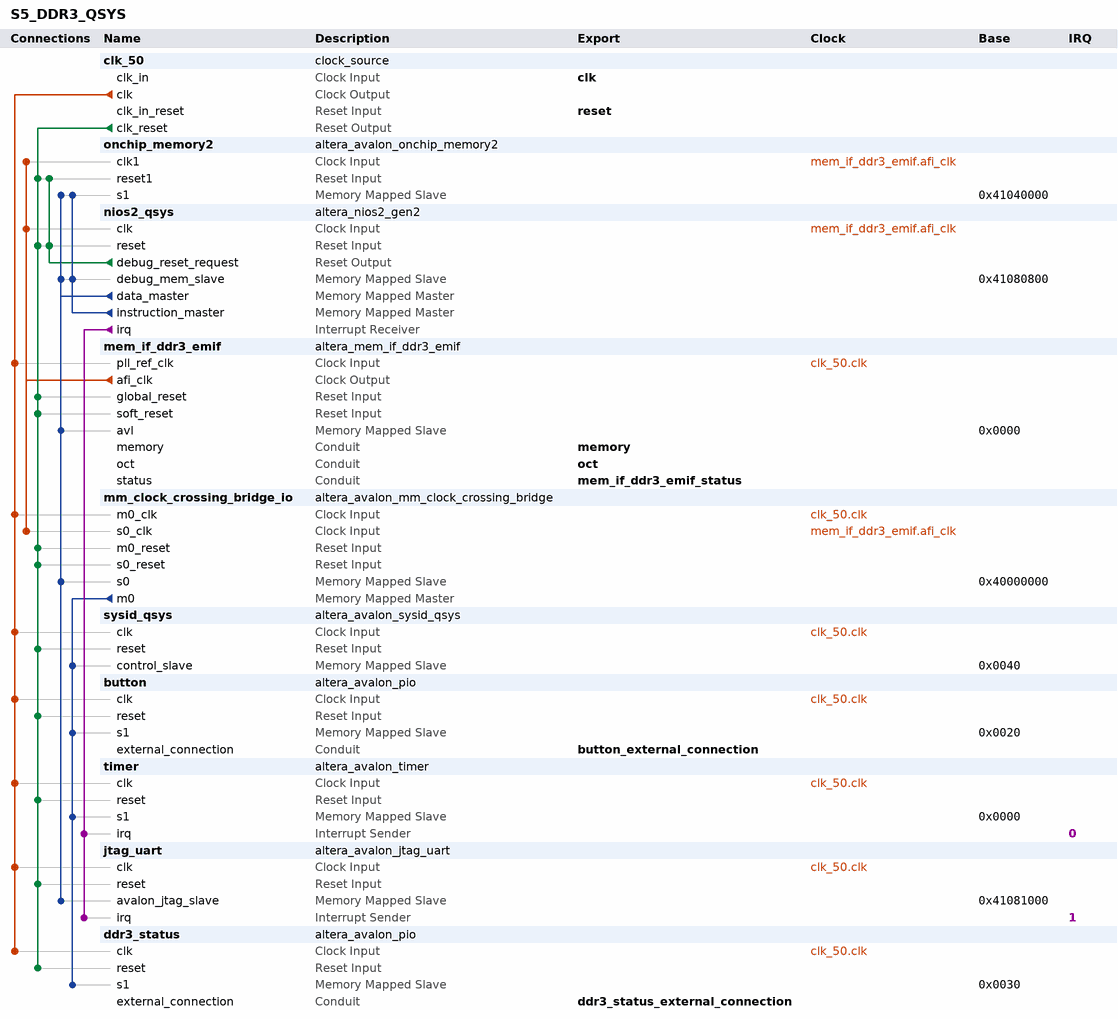
[diagram p0: system contents]
# Platform Designer (Qsys) system S5_DDR3_QSYS, Stratix V 5SGXEA7N2F45C2
# Parameters at their usual value, and those the tool derives, are not listed.
package require -exact qsys 16.1
create_system S5_DDR3_QSYS
set_project_property DEVICE_FAMILY {Stratix V}
set_project_property DEVICE 5SGXEA7N2F45C2

add_instance clk_50 clock_source 16.1
set_instance_parameter_value clk_50 clockFrequency 50000000

add_instance onchip_memory2 altera_avalon_onchip_memory2 16.1
set_instance_parameter_value onchip_memory2 dataWidth 32
set_instance_parameter_value onchip_memory2 dualPort false
set_instance_parameter_value onchip_memory2 initMemContent true
set_instance_parameter_value onchip_memory2 initializationFileName onchip_memory2
set_instance_parameter_value onchip_memory2 memorySize 256000

add_instance nios2_qsys altera_nios2_gen2 16.1
set_instance_parameter_value nios2_qsys dcache_size 2048
set_instance_parameter_value nios2_qsys exceptionSlave onchip_memory2.s1
set_instance_parameter_value nios2_qsys icache_size 4096
set_instance_parameter_value nios2_qsys impl Fast
set_instance_parameter_value nios2_qsys resetSlave onchip_memory2.s1
set_instance_parameter_value nios2_qsys setting_activateTrace true

add_instance mem_if_ddr3_emif altera_mem_if_ddr3_emif 16.1
set_instance_parameter_value mem_if_ddr3_emif AVL_MAX_SIZE 4
set_instance_parameter_value mem_if_ddr3_emif CALIBRATION_MODE Skip
set_instance_parameter_value mem_if_ddr3_emif CPORT_TYPE_PORT Bidirectional,Bidirectional,Bidirectional,Bidirectional,Bidirectional,Bidirectional
set_instance_parameter_value mem_if_ddr3_emif EXPORT_AFI_HALF_CLK false
set_instance_parameter_value mem_if_ddr3_emif HARD_EMIF false
set_instance_parameter_value mem_if_ddr3_emif MEM_BANKADDR_WIDTH 3
set_instance_parameter_value mem_if_ddr3_emif MEM_CLK_FREQ 800.0
set_instance_parameter_value mem_if_ddr3_emif MEM_CLK_FREQ_MAX 800.0
set_instance_parameter_value mem_if_ddr3_emif MEM_COL_ADDR_WIDTH 10
set_instance_parameter_value mem_if_ddr3_emif MEM_DQ_WIDTH 64
set_instance_parameter_value mem_if_ddr3_emif MEM_FORMAT UNBUFFERED
set_instance_parameter_value mem_if_ddr3_emif MEM_ROW_ADDR_WIDTH 14
set_instance_parameter_value mem_if_ddr3_emif MEM_TCL 11
set_instance_parameter_value mem_if_ddr3_emif MEM_TFAW_NS 30.0
set_instance_parameter_value mem_if_ddr3_emif MEM_TRAS_NS 35.0
set_instance_parameter_value mem_if_ddr3_emif MEM_TRCD_NS 13.75
set_instance_parameter_value mem_if_ddr3_emif MEM_TRFC_NS 160.0
set_instance_parameter_value mem_if_ddr3_emif MEM_TRP_NS 13.75
set_instance_parameter_value mem_if_ddr3_emif MEM_TRRD_NS 6.0
set_instance_parameter_value mem_if_ddr3_emif MEM_TRTP_NS 7.5
set_instance_parameter_value mem_if_ddr3_emif MEM_TWTR 4
set_instance_parameter_value mem_if_ddr3_emif MEM_VENDOR Micron
set_instance_parameter_value mem_if_ddr3_emif MEM_WTCL 8
set_instance_parameter_value mem_if_ddr3_emif PLL_LOCATION Left_Right
set_instance_parameter_value mem_if_ddr3_emif POWER_OF_TWO_BUS true
set_instance_parameter_value mem_if_ddr3_emif PRIORITY_PORT 0,1,1,1,1,1
set_instance_parameter_value mem_if_ddr3_emif RATE Quarter
set_instance_parameter_value mem_if_ddr3_emif REF_CLK_FREQ 50.0
set_instance_parameter_value mem_if_ddr3_emif SPEED_GRADE 2
set_instance_parameter_value mem_if_ddr3_emif TIMING_BOARD_AC_SKEW 0.05
set_instance_parameter_value mem_if_ddr3_emif TIMING_BOARD_AC_TO_CK_SKEW 0.012
set_instance_parameter_value mem_if_ddr3_emif TIMING_BOARD_DQ_TO_DQS_SKEW 0.002
set_instance_parameter_value mem_if_ddr3_emif TIMING_BOARD_MAX_CK_DELAY 1.78
set_instance_parameter_value mem_if_ddr3_emif TIMING_BOARD_MAX_DQS_DELAY 0.7
set_instance_parameter_value mem_if_ddr3_emif TIMING_BOARD_SKEW_BETWEEN_DQS 0.1
set_instance_parameter_value mem_if_ddr3_emif TIMING_BOARD_SKEW_CKDQS_DIMM_MAX 1.29
set_instance_parameter_value mem_if_ddr3_emif TIMING_BOARD_SKEW_CKDQS_DIMM_MIN 0.06
set_instance_parameter_value mem_if_ddr3_emif TIMING_BOARD_SKEW_WITHIN_DQS 0.009
set_instance_parameter_value mem_if_ddr3_emif TIMING_TDH 45
set_instance_parameter_value mem_if_ddr3_emif TIMING_TDQSCK 255
set_instance_parameter_value mem_if_ddr3_emif TIMING_TDQSQ 100
set_instance_parameter_value mem_if_ddr3_emif TIMING_TDQSS 0.27
set_instance_parameter_value mem_if_ddr3_emif TIMING_TDS 10
set_instance_parameter_value mem_if_ddr3_emif TIMING_TDSH 0.18
set_instance_parameter_value mem_if_ddr3_emif TIMING_TDSS 0.18
set_instance_parameter_value mem_if_ddr3_emif TIMING_TIH 120
set_instance_parameter_value mem_if_ddr3_emif TIMING_TIS 170
set_instance_parameter_value mem_if_ddr3_emif TIMING_TQSH 0.4
set_instance_parameter_value mem_if_ddr3_emif USER_DEBUG_LEVEL 0

add_instance mm_clock_crossing_bridge_io altera_avalon_mm_clock_crossing_bridge 16.1
set_instance_parameter_value mm_clock_crossing_bridge_io ADDRESS_WIDTH 10
set_instance_parameter_value mm_clock_crossing_bridge_io COMMAND_FIFO_DEPTH 4
set_instance_parameter_value mm_clock_crossing_bridge_io DATA_WIDTH 32
set_instance_parameter_value mm_clock_crossing_bridge_io MASTER_SYNC_DEPTH 2
set_instance_parameter_value mm_clock_crossing_bridge_io MAX_BURST_SIZE 1
set_instance_parameter_value mm_clock_crossing_bridge_io RESPONSE_FIFO_DEPTH 4
set_instance_parameter_value mm_clock_crossing_bridge_io SLAVE_SYNC_DEPTH 2
set_instance_parameter_value mm_clock_crossing_bridge_io USE_AUTO_ADDRESS_WIDTH 0

add_instance sysid_qsys altera_avalon_sysid_qsys 16.1
set_instance_parameter_value sysid_qsys id 1

add_instance button altera_avalon_pio 16.1
set_instance_parameter_value button direction Input
set_instance_parameter_value button width 4

add_instance timer altera_avalon_timer 16.1
set_instance_parameter_value timer period 1
set_instance_parameter_value timer periodUnits MSEC

add_instance jtag_uart altera_avalon_jtag_uart 16.1
set_instance_parameter_value jtag_uart simInteractiveOptions INTERACTIVE_ASCII_OUTPUT

add_instance ddr3_status altera_avalon_pio 16.1
set_instance_parameter_value ddr3_status direction Input
set_instance_parameter_value ddr3_status width 3

# connections
add_connection clk_50.clk button.clk clock
add_connection clk_50.clk ddr3_status.clk clock
add_connection clk_50.clk jtag_uart.clk clock
add_connection clk_50.clk mem_if_ddr3_emif.pll_ref_clk clock
add_connection clk_50.clk mm_clock_crossing_bridge_io.m0_clk clock
add_connection clk_50.clk sysid_qsys.clk clock
add_connection clk_50.clk timer.clk clock
add_connection mem_if_ddr3_emif.afi_clk mm_clock_crossing_bridge_io.s0_clk clock
add_connection mem_if_ddr3_emif.afi_clk nios2_qsys.clk clock
add_connection mem_if_ddr3_emif.afi_clk onchip_memory2.clk1 clock
add_connection clk_50.clk_reset button.reset reset
add_connection clk_50.clk_reset ddr3_status.reset reset
add_connection clk_50.clk_reset jtag_uart.reset reset
add_connection clk_50.clk_reset mem_if_ddr3_emif.global_reset reset
add_connection clk_50.clk_reset mem_if_ddr3_emif.soft_reset reset
add_connection clk_50.clk_reset mm_clock_crossing_bridge_io.m0_reset reset
add_connection clk_50.clk_reset mm_clock_crossing_bridge_io.s0_reset reset
add_connection clk_50.clk_reset nios2_qsys.reset reset
add_connection clk_50.clk_reset onchip_memory2.reset1 reset
add_connection clk_50.clk_reset sysid_qsys.reset reset
add_connection clk_50.clk_reset timer.reset reset
add_connection nios2_qsys.debug_reset_request nios2_qsys.reset reset
add_connection nios2_qsys.debug_reset_request onchip_memory2.reset1 reset
add_connection mm_clock_crossing_bridge_io.m0 button.s1 avalon
set_connection_parameter_value mm_clock_crossing_bridge_io.m0/button.s1 baseAddress 0x0020
add_connection mm_clock_crossing_bridge_io.m0 ddr3_status.s1 avalon
set_connection_parameter_value mm_clock_crossing_bridge_io.m0/ddr3_status.s1 baseAddress 0x0030
add_connection mm_clock_crossing_bridge_io.m0 sysid_qsys.control_slave avalon
set_connection_parameter_value mm_clock_crossing_bridge_io.m0/sysid_qsys.control_slave baseAddress 0x0040
add_connection mm_clock_crossing_bridge_io.m0 timer.s1 avalon
set_connection_parameter_value mm_clock_crossing_bridge_io.m0/timer.s1 baseAddress 0x0000
add_connection nios2_qsys.data_master jtag_uart.avalon_jtag_slave avalon
set_connection_parameter_value nios2_qsys.data_master/jtag_uart.avalon_jtag_slave baseAddress 0x41081000
add_connection nios2_qsys.data_master mem_if_ddr3_emif.avl avalon
set_connection_parameter_value nios2_qsys.data_master/mem_if_ddr3_emif.avl baseAddress 0x0000
add_connection nios2_qsys.data_master mm_clock_crossing_bridge_io.s0 avalon
set_connection_parameter_value nios2_qsys.data_master/mm_clock_crossing_bridge_io.s0 baseAddress 0x40000000
add_connection nios2_qsys.data_master nios2_qsys.debug_mem_slave avalon
set_connection_parameter_value nios2_qsys.data_master/nios2_qsys.debug_mem_slave baseAddress 0x41080800
add_connection nios2_qsys.data_master onchip_memory2.s1 avalon
set_connection_parameter_value nios2_qsys.data_master/onchip_memory2.s1 baseAddress 0x41040000
add_connection nios2_qsys.instruction_master nios2_qsys.debug_mem_slave avalon
set_connection_parameter_value nios2_qsys.instruction_master/nios2_qsys.debug_mem_slave baseAddress 0x41080800
add_connection nios2_qsys.instruction_master onchip_memory2.s1 avalon
set_connection_parameter_value nios2_qsys.instruction_master/onchip_memory2.s1 baseAddress 0x41040000
add_connection nios2_qsys.irq jtag_uart.irq interrupt
set_connection_parameter_value nios2_qsys.irq/jtag_uart.irq irqNumber 1
add_connection nios2_qsys.irq timer.irq interrupt
set_connection_parameter_value nios2_qsys.irq/timer.irq irqNumber 0

# exported interfaces
add_interface button_external_connection conduit end
set_interface_property button_external_connection EXPORT_OF button.external_connection
add_interface clk clock sink
set_interface_property clk EXPORT_OF clk_50.clk_in
add_interface ddr3_status_external_connection conduit end
set_interface_property ddr3_status_external_connection EXPORT_OF ddr3_status.external_connection
add_interface mem_if_ddr3_emif_status conduit end
set_interface_property mem_if_ddr3_emif_status EXPORT_OF mem_if_ddr3_emif.status
add_interface memory conduit end
set_interface_property memory EXPORT_OF mem_if_ddr3_emif.memory
add_interface oct conduit end
set_interface_property oct EXPORT_OF mem_if_ddr3_emif.oct
add_interface reset reset sink
set_interface_property reset EXPORT_OF clk_50.clk_in_reset

set_interconnect_requirement {$system} qsys_mm.clockCrossingAdapter HANDSHAKE
set_interconnect_requirement {$system} qsys_mm.maxAdditionalLatency 1

save_system S5_DDR3_QSYS.qsys
